# Altium schematic sheet ProjetMoteur.SchDoc
size A4
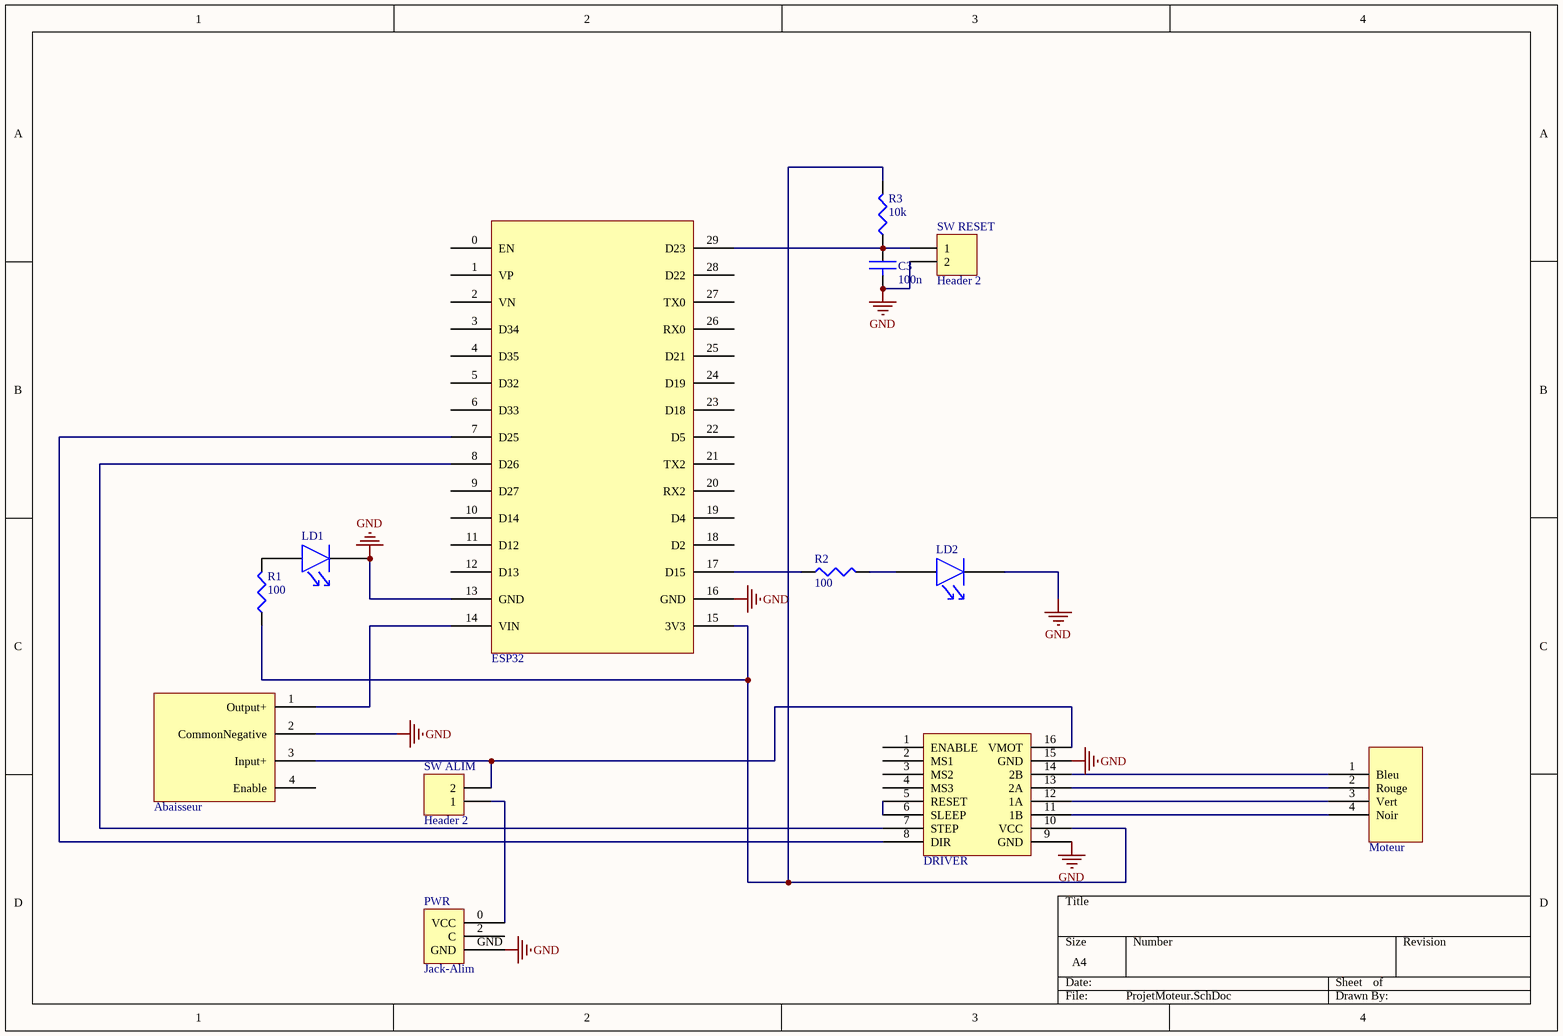
[diagram p0: ProjetMoteur.SchDoc]

## Parts
Abaisseur  Abaisseurtension  [AbaisseurTension]  (value not drawn)
C3  value 100n  [RAD0.1]  (hidden comment: CAP)
DRIVER  Driver  [Driver]  (value not drawn)
ESP32  ESP32devKit  [ESP32]  (value not drawn)
LD1  comment  [LED3]  (value not drawn)
LD2  comment  [LED3]  (value not drawn)
Moteur  Moteur  [Moteur]  (value not drawn)
PWR  Jack-Alim  [Connecteur Power]
R1  value 100  [AXIAL0.3]  (hidden comment: RES)
R2  value 100  [AXIAL0.3]  (hidden comment: RES)
R3  value 10k  [AXIAL0.3]  (hidden comment: RES)
SW_ALIM  Header 2  [HDR1X2]
SW_RESET  Header 2  [HDR1X2]

## Nets
GND: Abaisseur.2(CommonNegative) C3.2 DRIVER.9(GND) DRIVER.15(GND) ESP32.13(GND) ESP32.16(GND) LD1.K LD2.K PWR.GND SW_RESET.2
NetAbaisseur_1: Abaisseur.1(Output+) ESP32.14(VIN)
NetAbaisseur_3: Abaisseur.3(Input+) DRIVER.16(VMOT) SW_ALIM.2
NetC3_1: C3.1 ESP32.29(D23) R3.1 SW_RESET.1
NetDRIVER_5: DRIVER.5(RESET) DRIVER.6(SLEEP)
NetDRIVER_7: DRIVER.7(STEP) ESP32.8(D26)
NetDRIVER_8: DRIVER.8(DIR) ESP32.7(D25)
NetDRIVER_10: DRIVER.10(VCC) ESP32.15(3V3) R1.1 R3.2
NetDRIVER_11: DRIVER.11(1B) Moteur.4(Noir)
NetDRIVER_12: DRIVER.12(1A) Moteur.3(Vert)
NetDRIVER_13: DRIVER.13(2A) Moteur.2(Rouge)
NetDRIVER_14: DRIVER.14(2B) Moteur.1(Bleu)
NetESP32_17: ESP32.17(D15) R2.1
NetLD1_A: LD1.A R1.2
NetLD2_A: LD2.A R2.2
NetPWR_0: PWR.0(VCC) SW_ALIM.1

Not connected (* = marked no-connect by the designer): Abaisseur 4(Enable); DRIVER 1(ENABLE) 2(MS1) 3(MS2) 4(MS3); ESP32 0(EN) 1(VP) 2(VN) 3(D34) 4(D35) 5(D32) 6(D33) 9(D27) 10(D14) 11(D12) 12(D13) 18(D2) 19(D4) 20(RX2) 21(TX2) 22(D5) 23(D18) 24(D19) 25(D21) 26(RX0) 27(TX0) 28(D22); PWR 2(C)

## Library data of the parts
C3 = CAP: capacité non polarisée
DRIVER = Driver: Driver A4988
LD1 LD2 = LED: LED 5mm/3mm/CMS
R1-R3 = RES: resistance
SW_ALIM SW_RESET = Header 2: Header, 2-Pin; LatestRevisionDate: 17-Jul-2002; LatestRevisionNote: Re-released for DXP Platform.; Publisher: Altium Limited